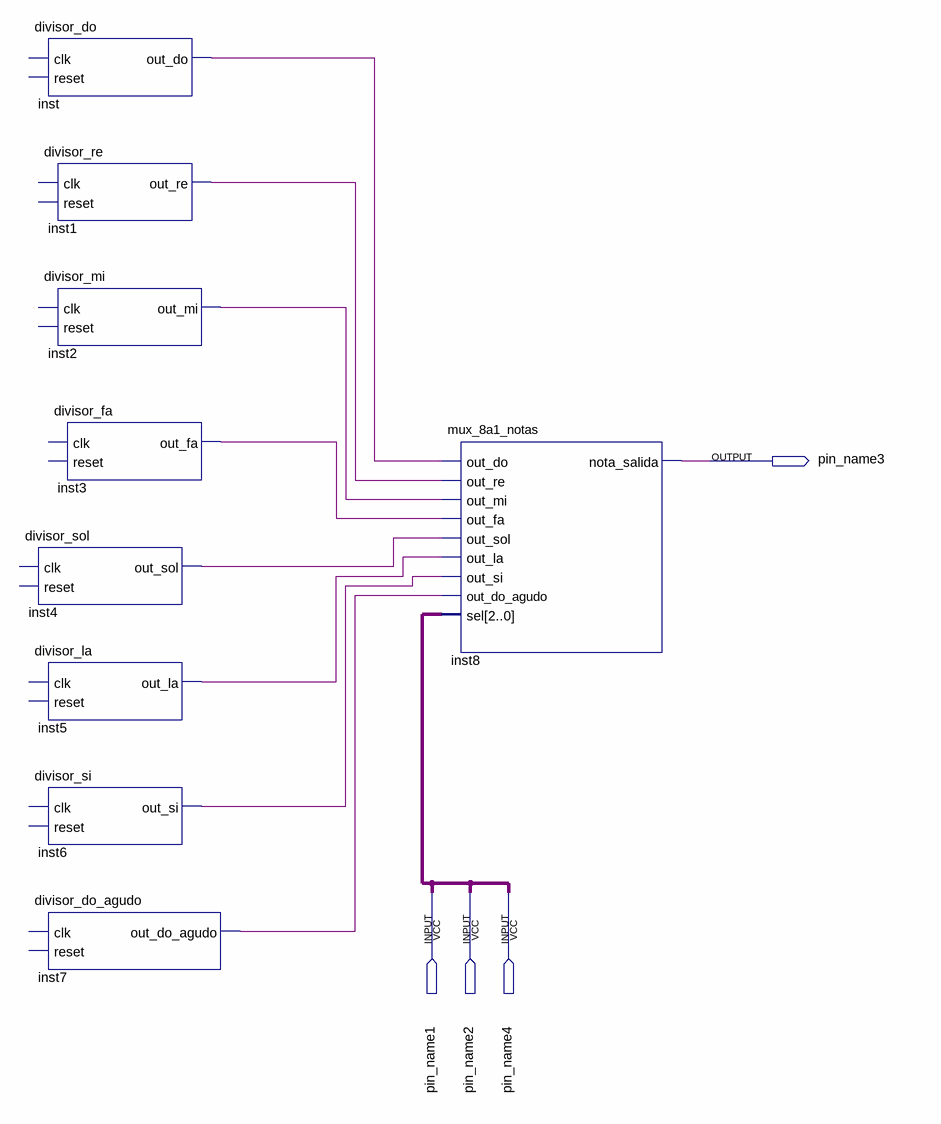
[diagram p0: schematic sheet]
// Quartus schematic Piano.bdf as structural Verilog: 9 symbols, 4 pins
module Piano (
  input  pin_name1,
  input  pin_name2,
  input  pin_name4,
  output pin_name3
);

  wire inst1_out_re, inst2_out_mi, inst3_out_fa, inst4_out_sol, inst5_out_la, inst6_out_si,
       inst7_out_do_agudo, inst_out_do;
  wire [2:0] undriven;

  divisor_do inst (.out_do(inst_out_do));  // open: clk, reset
  divisor_re inst1 (.out_re(inst1_out_re));  // open: clk, reset
  divisor_mi inst2 (.out_mi(inst2_out_mi));  // open: clk, reset
  divisor_fa inst3 (.out_fa(inst3_out_fa));  // open: clk, reset
  divisor_sol inst4 (.out_sol(inst4_out_sol));  // open: clk, reset
  divisor_la inst5 (.out_la(inst5_out_la));  // open: clk, reset
  divisor_si inst6 (.out_si(inst6_out_si));  // open: clk, reset
  divisor_do_agudo inst7 (.out_do_agudo(inst7_out_do_agudo));  // open: clk, reset
  mux_8a1_notas inst8 (
    .out_do(inst_out_do), .out_re(inst1_out_re), .out_mi(inst2_out_mi), .out_fa(inst3_out_fa),
    .out_sol(inst4_out_sol), .out_la(inst5_out_la), .out_si(inst6_out_si), .out_do_agudo(inst7_out_do_agudo),
    .sel(undriven), .nota_salida(pin_name3));
endmodule
